# Altium project PowerHAT.PrjPCB
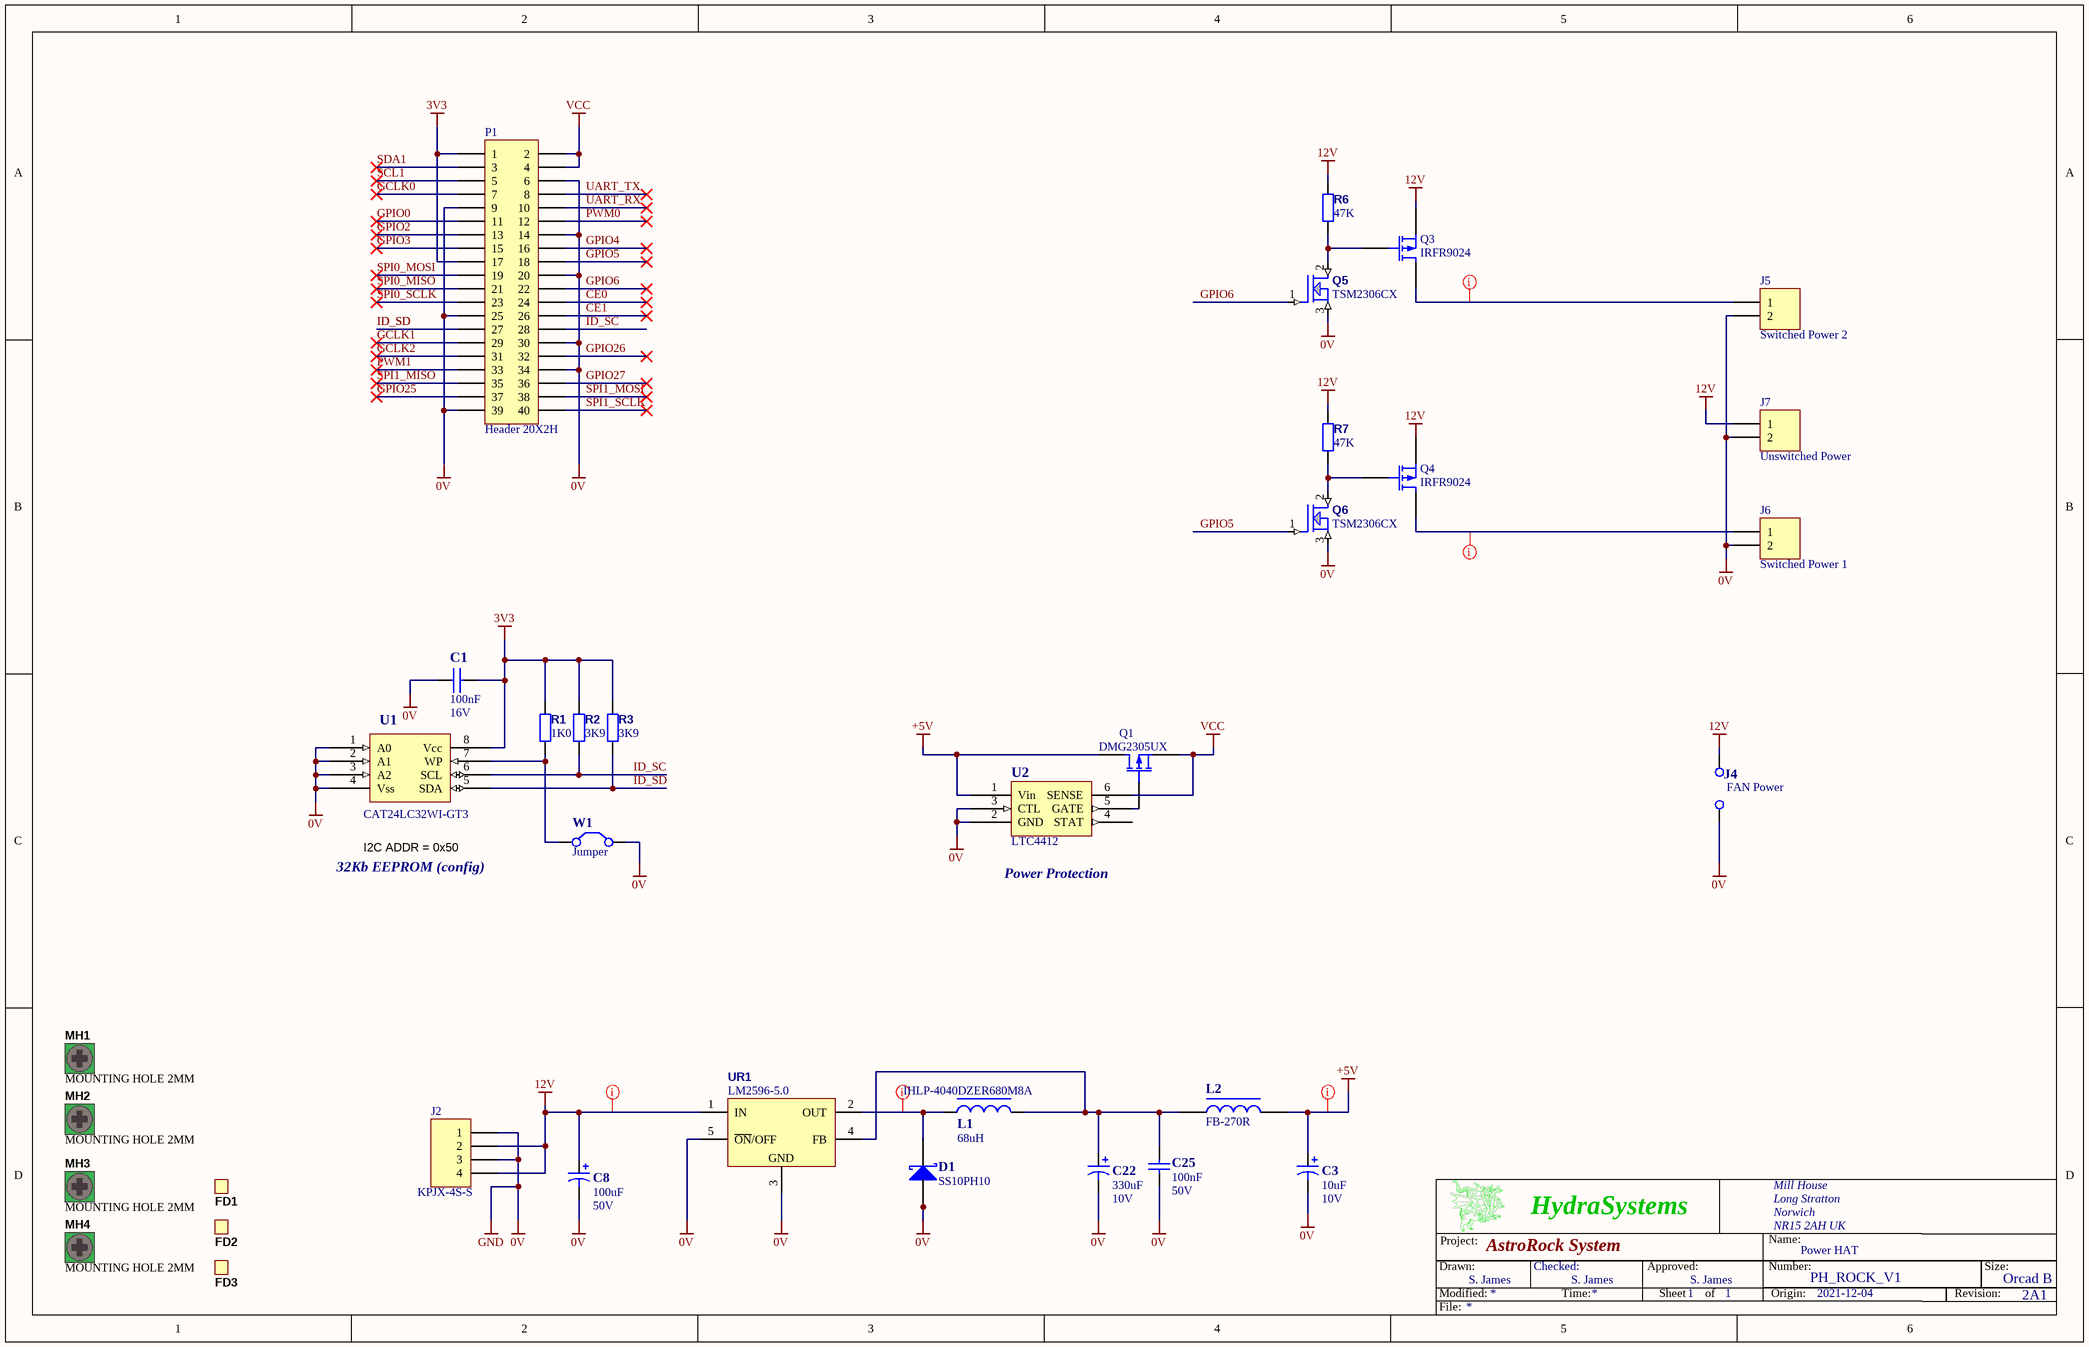
[diagram p0: PowerHAT_1B1.SchDoc]
1 sheet, 35 parts. Net scope: global (net labels, ports and power ports of the same name join across sheets).
Board file: PowerHAT_1B2.PcbDoc

## Sheet PowerHAT_1B1.SchDoc: Power HAT
size OrCAD B; Date: 2021-12-04; ApprovedBy: S. James; CheckedBy: S. James; Author: S. James; CompanyName: HydraSystems; DrawnBy: S. James; Address1: Mill House; Address2: Long Stratton; Address3: Norwich; Address4: NR15 2AH UK; DocumentNumber: PH_ROCK_V1; Revision: 2A1; SheetNumber: 1; SheetTotal: 1; Project: AstroRock System; CurrentDate: 2022-04-14; DocumentName: Power HAT

### Parts
C1  100nF  Voltage: 16V  [0603_C]
C3  10uF  Voltage: 10V  [1206]
C8  100uF  Voltage: 50V  [CASE H]
C22  330uF  Voltage: 10V  [2812]
C25  100nF  Voltage: 50V  [SM/R_0603]
D1  SS10PH10  [TO-277A]
FD1  Fiducial  [Fiducial]  (value not drawn)  (no BOM)
FD2  Fiducial  [Fiducial]  (value not drawn)  (no BOM)
FD3  Fiducial  [Fiducial]  (value not drawn)  (no BOM)
J2  KPJX-4S-S  [KPJX-4S-S]
J4  FAN Power  [CON2]
J5  Switched Power 2  [DCJ250-20]
J6  Switched Power 1  [DCJ250-20]
J7  Unswitched Power  [DCJ250-20]
L1  68uH  Part Number 68: IHLP-4040DZER680M8A  [IHLP4040DZER]
L2  FB-270R  [2220]
MH1  MOUNTING HOLE 2MM  [MOUNTING_HOLE_2MM]  (no BOM)
MH2  MOUNTING HOLE 2MM  [MOUNTING_HOLE_2MM]  (no BOM)
MH3  MOUNTING HOLE 2MM  [MOUNTING_HOLE_2MM]  (no BOM)
MH4  MOUNTING HOLE 2MM  [MOUNTING_HOLE_2MM]  (no BOM)
P1  Header 20X2H  [Header40 Invert]
Q1  DMG2305UX  [DMG2305]
Q3  IRFR9024  [TO-252AA]
Q4  IRFR9024  [TO-252AA]
Q5  TSM2306CX  [FDV301N]
Q6  TSM2306CX  [FDV301N]
R1  1K0  [SM/R_0603]
R2  3K9  [SM/R_0603]
R3  3K9  [SM/R_0603]
R6  47K  [SM/R_0603]
R7  47K  [SM/R_0603]
U1  CAT24LC32WI-GT3  [SO-8]
U2  LTC4412  [SOT23-6_M]
UR1  LM2596-5.0  [LM2596]
W1  Jumper  [Link2]

### Nets
0V: C1.1 C3.2 C8.2 C22.2 C25.1 D1.2(A1) D1.3(A2) J2.1 J2.3 J4.1(C1) J5.2 J6.2 J7.2 P1.6 P1.9 P1.14 P1.20 P1.25 P1.30 P1.34 P1.39 Q5.3(S) Q6.3(S) U1.1(A0) U1.2(A1) U1.3(A2) U1.4(Vss) U2.2(GND) U2.3(CTL) UR1.3(GND) UR1.5(~{ON}/OFF) W1.2(C2)  [also labelled GND]
3V3: C1.2 P1.1 P1.17 R1.2 R2.2 R3.2 U1.8(Vcc)
12V: C8.1 J2.2 J2.4 J4.2(C2) J7.1 Q3.3(S) Q4.3(S) R6.2 R7.2 UR1.1(IN)
+5V: C3.1 L2.2 Q1.1(D) U2.1(Vin)
VCC: P1.2 P1.4 Q1.3(S) U2.6(SENSE)
CE0: P1.24
CE1: P1.26
GCLK0: P1.7
GCLK1: P1.29
GCLK2: P1.31
GPIO0: P1.11
GPIO2: P1.13
GPIO3: P1.15
GPIO4: P1.16
GPIO5: P1.18 Q6.1(G)
GPIO6: P1.22 Q5.1(G)
GPIO25: P1.37
GPIO26: P1.32
GPIO27: P1.36
ID_SC: P1.28 R2.1 U1.6(SCL)
ID_SD: P1.27 R3.1 U1.5(SDA)
PWM0: P1.12
PWM1: P1.33
SCL1: P1.5
SDA1: P1.3
SPI0_MISO: P1.21
SPI0_MOSI: P1.19
SPI0_SCLK: P1.23
SPI1_MISO: P1.35
SPI1_MOSI: P1.38
SPI1_SCLK: P1.40
UART_RX: P1.10
UART_TX: P1.8
NetC22_1: C22.1 C25.2 L1.2 L2.1 UR1.4(FB)
NetD1_1: D1.1(K) L1.1 UR1.2(OUT)
NetJ5_1: J5.1 Q3.1(D)
NetJ6_1: J6.1 Q4.1(D)
NetQ1_2: Q1.2(G) U2.5(GATE)
NetQ3_2: Q3.2(G) Q5.2(D) R6.1
NetQ4_2: Q4.2(G) Q6.2(D) R7.1
NetR1_1: R1.1 U1.7(WP) W1.1(C1)

Not connected (* = marked no-connect by the designer): MH1 MOUNT; MH2 MOUNT; MH3 MOUNT; MH4 MOUNT; U2 4(STAT)

### Layout directives
net class PowerClass: 12V, +5V, NetD1_1, NetJ5_1, NetJ6_1

### Notes on the sheet
- 32Kb EEPROM (config)
- I2C ADDR = 0x50
- (near U2) Power Protection
- HydraSystems
- Modified:
- Drawn:
- Project:
- Checked:
- Time:
- Approved:
- Sheet
- of
- Number:
- Name:
- Origin:
- Revision:
- Size:
- Orcad B
- File:

### Library data of the parts
C1 = CAPACITOR NON-POL: MLCC 100nF 0402 X7R 16V; Text Field1: 20; Text Field2: 10; Capacitance: 100nF; Dielectric: X7R
C3 C22 = Cap Pol3: Polarized Capacitor (Surface Mount)
  C3: Value: 10uF
  C22: Value: 330uF
C8 = Cap Pol3: Polarized Capacitor (Surface Mount); Multicomp PN: MCESL50V107M8X10.5; Value: 100uF; Farnell PN: 926-5775
C25 = Cap: Capacitor; Farnell PN: 114-1772; Value: 100nF
D1 = SS10PH: Schottky Rectifier; Manufacturer: Vishay; Farnell PN: 181-5648; Manufacturer PN: SS10PH10
FD1-FD3 = Fiducial: Registration Fiducial; Category: Graphic-PCB; Status: Production
J2 = Header 4: Power 4-Pin; LatestRevisionDate: 17-Jul-2002; LatestRevisionNote: Re-released for DXP Platform.; Publisher: Altium Limited; Farnell: 283-9851; Kycom: KPJX-4S-S
J4 = Pads: 2 pads; Published: 24-Mar-1999; LatestRevisionDate: 17-Jul-2002; LatestRevisionNote: Re-released for DXP Platform.; PackageReference: RAD-0.2; Publisher: Altium Limited
J5-J7 = Header 2: Power Jack; GCT: DCJ250-20-B-K1-A; LatestRevisionDate: 17-Jul-2002; LatestRevisionNote: Re-released for DXP Platform.; Publisher: Altium Limited; Farnell: 267-3247
L1 = Ferrite Inductor: Manufacturer: Vishay; Value47: 47uH; Saturation Current: 4.1A; Part Number 47: IHLP-4040DZER470M11; Farnell Number 47: 154-7059; Value68: 68uH; Farnell Number 68: 296-5633
L2 = Ferrite Bead: Manufacturer: Wurth; Manufacturer PN: 74279224271; Value: FB-270R; Farnell Number: 206-6850
MH1-MH4 = MOUNTING_HOLE_2MM: Mounting Hole, M2 Screw, Plated, Square Pad; Category: Mounting-Hole; Status: Production
P1 = Header 20X2H: Header, 20-Pin, Dual row, Right Angle; LatestRevisionDate: 17-Jul-2002; LatestRevisionNote: Re-released for DXP Platform.; Publisher: Altium Limited
Q1 = DMG2305UX: P-Channel MOSFET; Published: 8-Jun-2000; LatestRevisionDate: 17-Jul-2002; LatestRevisionNote: Re-released for DXP Platform.; PackageVersion: 1995/1996; PackageReference: E3; Publisher: Altium Limited; PackageDescription: TO, Flat Index; 3 In-Line, Axial Leads; Body Dia. 4.6mm; Lead Dia. 0.5 mm (max)
Q3 Q4 = MOSFET-P: P-Channel MOSFET; Published: 8-Jun-2000; LatestRevisionDate: 17-Jul-2002; LatestRevisionNote: Re-released for DXP Platform.; PackageVersion: 1995/1996; PackageReference: E3; Publisher: Altium Limited; PackageDescription: TO, Flat Index; 3 In-Line, Axial Leads; Body Dia. 4.6mm; Lead Dia. 0.5 mm (max)
Q5 Q6 = FDV301N: MOSFET, N Channel, 30 V, 3.5 A, 0.046 ohm, SOT-23; Full Part Number: TSM2306CX RFG; Name: TSM2306CX; Farnell: 186-4577
R1-R3 R6 R7 = Res2: Resistor; Published: 8-Jun-2000; LatestRevisionDate: 17-Jul-2002; LatestRevisionNote: Re-released for DXP Platform.; PackageReference: AXIAL-0.4; Publisher: Altium Limited; PackageDescription: Axial Device, Thru-Hole; 2 Leads; 0.4 in Pin Spacing
  R1: Value: 1K0
  R2 R3: Value: 3K9
  R6 R7: Value: 47K
U1 = 24LC00: Text Field1: 60; Text Field2: 50
U2 = LTC4412: Text Field1: 60; Text Field2: 50
UR1 = LM2596-ADJ: 1000mA DC/DC Convertor, 3-pin SIP; PartNumber: TO-263; TI PN: LM2596-5.0; PinCount: 4; Farnell: 300-8164
W1 = Jumper: Jumper Wire; Published: 24-Mar-1999; LatestRevisionDate: 17-Jul-2002; LatestRevisionNote: Re-released for DXP Platform.; PackageReference: RAD-0.2; Publisher: Altium Limited